# EasyEDA Pro project PrototypeBoardV1A.eprj

# Schematic Schematic1
Board Name: Board1; Create Date: 2025-06-25; Page Name: P1; Project Name: PrototypeBoardV1A; Schematic Name: Schematic1; Update Date: 2025-06-25; Company: m039; Drawn: Dmitry Mozgin; Page Size: A4; Version: V1.0
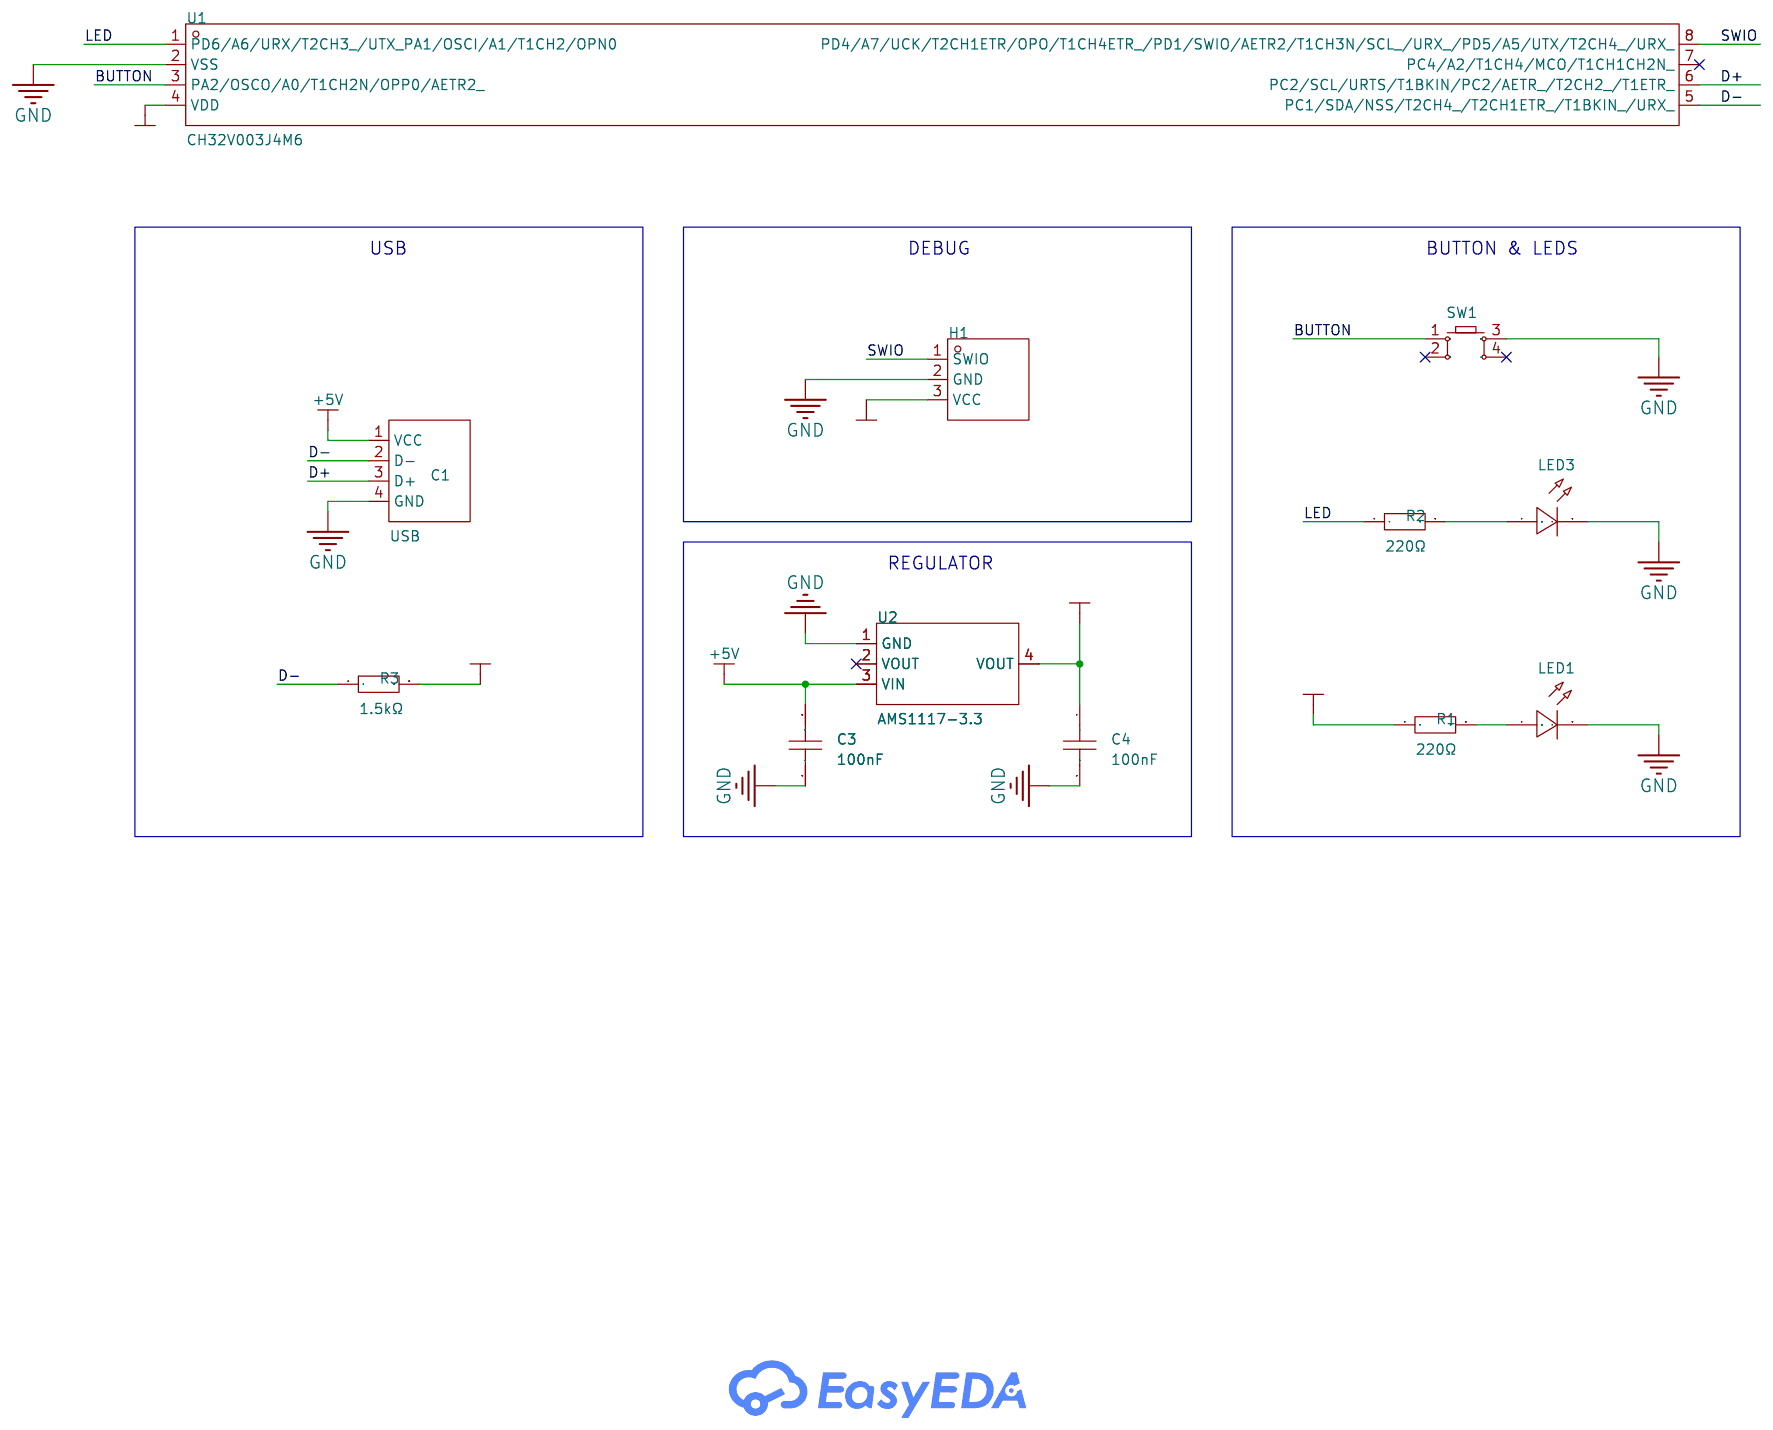
[diagram p0: schematic sheet]

## Parts
C1  USB  [USB Type-C 4P]
C3  100nF  [CAP-TH_L5.8-W3.0-P4.7-D0.45]
C4  100nF  [CAP-TH_L5.8-W3.0-P4.7-D0.45]
H1  -  [HDR-TH_3P-P2.54-V-M]
LED1  -  [LED-TH_BD3.0-P2.54-FD]
LED3  -  [LED-TH_BD3.8-P2.54-FD_BLUE]
R1  220Ω  [RES-TH_BD1.8-L3.2-P7.20-D0.4]
R2  220Ω  [RES-TH_BD1.8-L3.2-P7.20-D0.4]
R3  1.5kΩ  [RES-TH_BD1.8-L3.2-P7.20-D0.4]
SW1  -  [KEY-TH_4P-L6.0-W6.0-P3.90-LS6.5]
U1  CH32V003J4M6  [SOP-8_L4.9-W3.8-P1.27-LS6.0-BL]
U2  AMS1117-3.3  [SOT-223-3_L6.5-W3.4-P2.30-LS7.0-BR]

## Library data of the parts
C1 = USB Type-C 4P Board
C3 C4 = 1C10Z5U104M050B: LCSC Part Name: 100nF ±20% 50V; Supplier Part: C3009699; Manufacturer: VISHAY(威世); Supplier Footprint: 插件,P=10mm; JLCPCB Part Class: Extended Part; Datasheet: https://atta.szlcsc.com/upload/public/pdf/source/20210701/0CF1A7AD3406E72B391D35880AF61B15.pdf; Supplier: LCSC; Tolerance: ±20%; Voltage Rating: 50V; Pin Spacing: 2.54mm; Temperature Coefficient: Z5U; Diameter: 5.08mm; Body Thickness: 3.18mm
H1 = HDR-M_2.54_1x3P: Supplier Footprint: Through
LED1 = LED_TH-R_3mm: Supplier Footprint: Through
LED3 = LED_TH-B_3mm: Supplier Footprint: Through
R1-R3 = Res_AXIAL-1/8W: Supplier Footprint: Through
SW1 = Key_TH_6x6x4.5: Supplier Footprint: Through
U1 = CH32V003J4M6_C5346354: Supplier Part: C5346354; Manufacturer: WCH(南京沁恒); Supplier Footprint: SOP-8; JLCPCB Part Class: Extended Part; Datasheet: https://atta.szlcsc.com/upload/public/pdf/source/20240313/8FAFD0DE100342130E64AE37B01CD8FD.pdf; Supplier: LCSC
U2 = AMS1117-3.3_C6186: LCSC Part Name: 输出3.3V 1A; Supplier Part: C6186; Manufacturer: AMS; Supplier Footprint: SOT-223; JLCPCB Part Class: Basic Part; Datasheet: https://atta.szlcsc.com/upload/public/pdf/source/20180727/C6186_7A095716F0823C02F1997A905E26C086.pdf; Supplier: LCSC; Output Type: Fixed; Voltage - Supply: 16V; Output Voltage: 3.3V; Output Current: 1A; Power Supply Rejection Ratio (PSRR): 72dB@(120Hz); Voltage Dropout: 1.1V@(800mA); standby current: 5mA; Features: Over Current Protection；Over Temperature Protection; Operating Temperature: -40℃~+125℃; Output Configuration: Positive; Number of Outputs: 1

## Nets
+3.3V: C4.1 H1.3(VCC) R1.1 R3.2 U1.4(VDD) U2.4(VOUT)
+5V: C1.1(VCC) C3.2 U2.3(VIN)
GND: C1.4(GND) C3.1 C4.2 H1.2(GND) LED1.2(A) LED3.2(A) SW1.3 U1.2(VSS) U2.1(GND)
BUTTON: SW1.1 U1.3(PA2/OSCO/A0/T1CH2N/OPP0/AETR2_)
D+: C1.3(D+) U1.6(PC2/SCL/URTS/T1BKIN/PC2/AETR_/T2CH2_/T1ETR_)
D-: C1.2(D-) R3.1 U1.5(PC1/SDA/NSS/T2CH4_/T2CH1ETR_/T1BKIN_/URX_)
LED: R2.1 U1.1(PD6/A6/URX/T2CH3_/UTX_PA1/OSCI/A1/T1CH2/OPN0)
SWIO: H1.1(SWIO) U1.8(PD4/A7/UCK/T2CH1ETR/OPO/T1CH4ETR_/PD1/SWIO/AETR2/T1CH3N/SCL_/URX_/PD5/A5/UTX/T2CH4_/URX_)
$1N1276: LED1.1(C) R1.2
$1N2333: LED3.1(C) R2.2

Not connected (* = marked no-connect by the designer): SW1 2* 4*; U1 7(PC4/A2/T1CH4/MCO/T1CH1CH2N_)*; U2 2(VOUT)*

## Notes on the sheet
- USB
- DEBUG
- BUTTON & LEDS
- REGULATOR

# Board PCB1
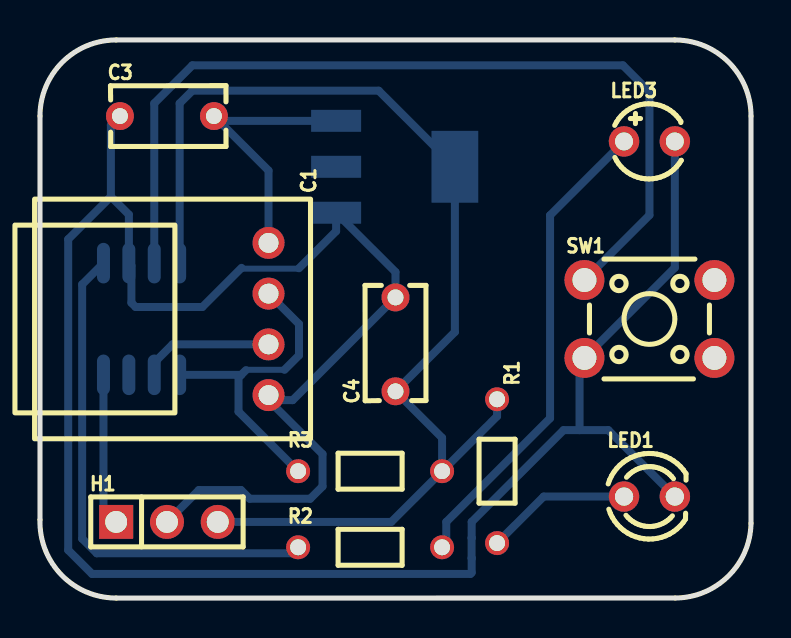
[diagram p1: board, top side]
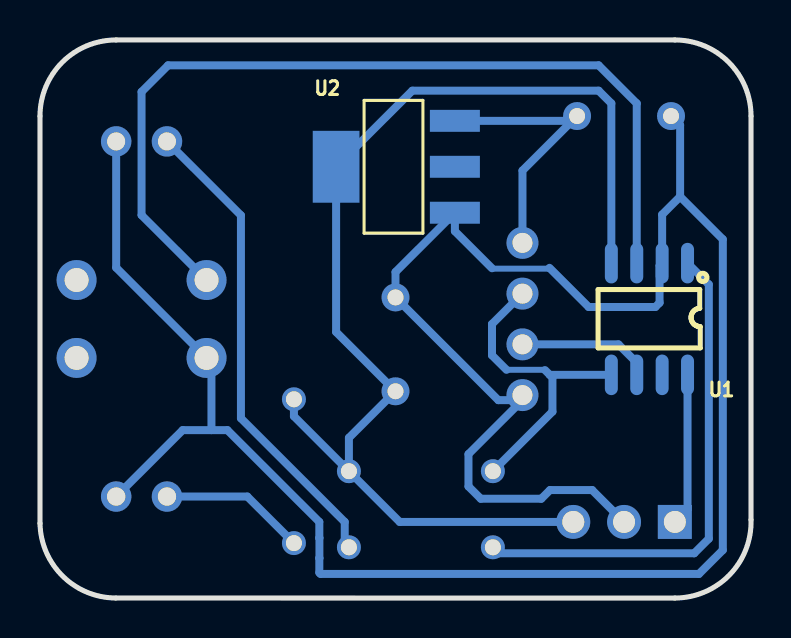
[diagram p2: board, bottom side, seen from below]

Outline 35.56 x 27.94 mm; copper layers: Top Layer, Bottom Layer. Coordinates in mm from the lower left corner of the outline.
Outline path: 0,24.13 0,3.92 arc(1.08,1.15) 3.81,0 31.77,0 arc(34.43,1.1) 35.56,3.74 35.56,24.13 arc(34.44,26.82) 31.75,27.94 3.81,27.94 arc(1.12,26.83) 0,24.13
Stack: Top Layer 0.035mm / Dielectric1 1.51mm FR4 er 4.5 / Bottom Layer 0.035mm

## Design rules (mm)
template: Custom Config
spacing copperThickness1oz (default): track to track 0.3, other pairs 0.152 to 0.3
spacing copperThickness2oz: track to track 0.203, other pairs 0.152 to 0.3
track width copperThickness1oz (default): min 0.127, default 0.3, max 2.54
track width copperThickness2oz: min 0.203, default 0.254, max 2.54
differential pair differentialPair (default): width min 0.127, default 0.254, max 2.54; gap min 0.152, default 0.152
via viaSize (default): diameter min 0.5, default 0.61, max 10; hole min 0.3, default 0.305, max 6.3

## Placement (name value [footprint] x y rotation side)
C1  USB  [USB Type-C 4P]  11.43 13.97 270 top
C3  100nF  [CAP-TH_L5.8-W3.0-P4.7-D0.45]  6.35 24.13 0 top
C4  100nF  [CAP-TH_L5.8-W3.0-P4.7-D0.45]  17.78 12.7 90 top
H1  -  [HDR-TH_3P-P2.54-V-M]  6.35 3.81 0 top
LED1  -  [LED-TH_BD3.0-P2.54-FD]  30.48 5.08 0 top
LED3  -  [LED-TH_BD3.8-P2.54-FD_BLUE]  30.48 22.86 0 top
R1  220Ω  [RES-TH_BD1.8-L3.2-P7.20-D0.4]  22.86 6.35 270 top
R2  220Ω  [RES-TH_BD1.8-L3.2-P7.20-D0.4]  16.51 2.54 0 top
R3  1.5kΩ  [RES-TH_BD1.8-L3.2-P7.20-D0.4]  16.51 6.35 0 top
SW1  -  [KEY-TH_4P-L6.0-W6.0-P3.90-LS6.5]  30.48 13.97 0 top
U1  CH32V003J4M6  [SOP-8_L4.9-W3.8-P1.27-LS6.0-BL]  5.08 13.97 0 bottom
U2  AMS1117-3.3  [SOT-223-3_L6.5-W3.4-P2.30-LS7.0-BR]  17.78 21.59 180 bottom

## Footprints (pads in the part's own frame, mm; a bottom-side part is the same pattern mirrored in y, then rotated)
CAP-TH_L5.8-W3.0-P4.7-D0.45
  round 1.4 hole 0.8: 1(-2.35,0) 2(2.35,0)
HDR-TH_3P-P2.54-V-M
  rect 1.7x1.7 hole 1.1: 1(-2.54,0)
  round 1.7 hole 1.1: 2(0,0) 3(2.54,0)
KEY-TH_4P-L6.0-W6.0-P3.90-LS6.5
  round 2 hole 1.2: 1(-3.25,1.95) 2(3.25,1.95) 3(-3.25,-1.95) 4(3.25,-1.95)
LED-TH_BD3.0-P2.54-FD
  round 1.524 hole 0.914: 1(-1.27,0) 2(1.27,0)
LED-TH_BD3.8-P2.54-FD_BLUE
  round 1.524 hole 0.9: 1(-1.27,0) 2(1.27,0)
RES-TH_BD1.8-L3.2-P7.20-D0.4
  round 1.2 hole 0.8: 1(-3.6,0) 2(3.6,0)
SOP-8_L4.9-W3.8-P1.27-LS6.0-BL
  oval 0.65x2.032 smd: 1(-1.905,-2.796) 2(-0.635,-2.796) 3(0.635,-2.796) 4(1.905,-2.796) 5(1.905,2.796) 6(0.635,2.796) 7(-0.635,2.796) 8(-1.905,2.796)
SOT-223-3_L6.5-W3.4-P2.30-LS7.0-BR
  rect 2.5x1.1 smd: 1(2.97,-2.3) 2(2.97,0) 3(2.97,2.3)
  rect 2.34x3.6 smd: 4(-2.97,0)
USB Type-C 4P
  round 1.6 hole 1: 1(-3.81,0) 2(-1.27,0) 3(1.27,0) 4(3.81,0)

## Nets
As in the schematic.

Pads without a net: SW1 2 4; U1 7; U2 2

## Routing (per net, layer and track width the routed paths; a pad name or vN(x,y) marks a point on that pad's centre or on a via; arc(x,y) is an arc through that point)
+3.3V: length 58.1
  Bottom Layer w0.4: U1.4 6.99,24.77 7.62,25.4 16.94,25.4 U2.4 20.75,13.32 C4.1 20.11,8.02 R3.2 ; R3.2 22.86,9.1 R1.1 ; R3.2 17.57,3.81 H1.3
+5V: length 13.2
  Bottom Layer w0.4: 8.94,23.89 11.43,21.4 11.43,17.91 ; 8.94,23.89 C3.2 ; 8.94,23.89 U2.3
GND: length 122.7
  Bottom Layer w0.3: 12.93,16.49 10.12,16.49 10.08,16.53
  Bottom Layer w0.4: 10.08,16.53 8.12,14.57 4.78,14.57 4.57,14.78 4.57,16.64 4.44,16.77 4.44,19.2 3.54,20.1 ; 26.99,8.41 26.99,11.78 SW1.3 31.75,16.54 LED3.2 ; 26.99,8.41 26.19,8.41 21.59,3.81 21.59,3.01 21.59,3.01 21.59,2 21.59,2 21.59,1.27 21.53,1.21 2.6,1.21 1.41,2.4 1.41,17.96 3.54,20.1 ; 26.99,8.41 28.42,8.41 LED1.2 ; 12.95,16.51 14.81,18.37 U2.1 17.78,16.32 C4.2 12.64,9.91 11.43,9.91 14.13,7.21 14.13,5.59 13.51,4.97 10.49,4.97 10.05,5.41 7.95,5.41 H1.2 ; C3.1 3.54,23.68 3.54,20.1
BUTTON: length 44.9
  Bottom Layer w0.4: U1.3 5.72,24.77 7.62,26.67 29.15,26.67 30.48,25.34 30.48,19.17 SW1.1
D+: length 6.7
  Bottom Layer w0.4: C1.3 6.63,12.7 5.73,11.8 5.73,11.19 U1.6
D-: length 16.2
  Bottom Layer w0.3: 10.31,11.43 12.23,11.43
  Bottom Layer w0.4: R3.1 9.93,9.33 9.93,11.04 10.06,11.18 ; 10.06,11.18 10.3,11.41 ; 10.06,11.18 U1.5 ; 12.23,11.43 12.95,12.15 12.95,13.72 C1.2
LED: length 25.5
  Bottom Layer w0.4: R2.1 12.61,2.24 2.84,2.24 2.11,2.97 2.11,15.7 U1.1
SWIO: length 7.6
  Bottom Layer w0.4: U1.8 3.18,4.45 H1.1
$1N1276: length 7.3
  Bottom Layer w0.4: R1.2 25.19,5.08 LED1.1
$1N2333: length 24.1
  Bottom Layer w0.4: LED3.1 25.51,19.16 25.51,9 20.32,3.81 20.32,2.75 R2.2
